# Altium schematic sheet power.SchDoc
size A4
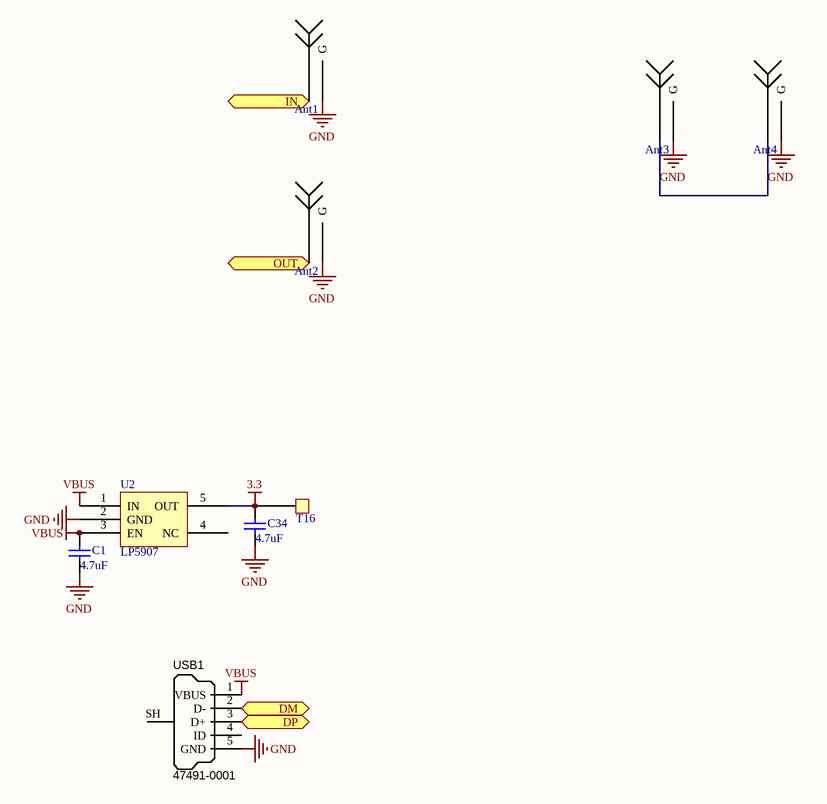
[diagram p0: power.SchDoc]

## Parts
Ant1  Antenna  [SMA-2]  (value not drawn)
Ant2  Antenna  [SMA-2]  (value not drawn)
Ant3  Antenna  [SMA-2]  (value not drawn)
Ant4  Antenna  [SMA-2]  (value not drawn)
C1  4.7uF  [0603]
C34  4.7uF  [0603]
T16  TestPad  [TestPad - 1mm]  (value not drawn)
U2  LP5907  [SOT23-5]
USB1  Manufacturer Part Number 1: 47491-0001  [MICRO-YZX]  (hidden comment: USB Micro Type B)

## Ports
DM, DP, IN (in), OUT (out)

## Nets
3.3: C34.2 T16.1 U2.5(OUT)
GND: Ant1.GND(G) Ant2.GND(G) Ant3.GND(G) Ant4.GND(G) C1.1 C34.1 U2.2(GND) USB1.5(GND)
VBUS: C1.2 U2.1(IN) U2.3(EN) USB1.1(VBUS)
DM: USB1.2(D-) ; port DM
DP: USB1.3(D+) ; port DP
IN: Ant1.1 ; port IN
OUT: Ant2.1 ; port OUT
NetAnt3_1: Ant3.1 Ant4.1

Not connected (* = marked no-connect by the designer): U2 4(NC); USB1 4(ID) SH(Shell)

## Library data of the parts
C1 C34 = Cap: Capacitor; Published: 8-Jun-2000; LatestRevisionDate: 17-Jul-2002; LatestRevisionNote: Re-released for DXP Platform.; PackageReference: RAD-0.3; Publisher: Altium Limited; PackageDescription: Radial Cap, Thru-Hole; 2 Leads; 0.3 in Pin Spacing
USB1 = USB_Micro_TypeB: Connector SMD USB Micro Type B middle mount; Manufacturer 1: Molex Inc; SCDType: undef; Package / Case: SMD; Supplier 1: Digi-Key; Supplier Part Number 1: WM17142CT-ND